# Altium schematic sheet Main.SchDoc
size A4; DrawnBy: Björn Seip; PageSetup: Record=PageOptions|CenterHorizontal=True|CenterVertical=True|PrintScale=0.97|XCorrection=1.00|YCorrection=1.00|PrintKind=0|BorderSize=5000000|LeftOffset=0|BottomOffset=0|Orientation=2|PaperLength=1000|PaperWidth=1000|Scale=100|PaperSource=7|PrintQuality=-4|MediaType=1|DitherType=10|PaperKind=A4|PrintScaleMode=1
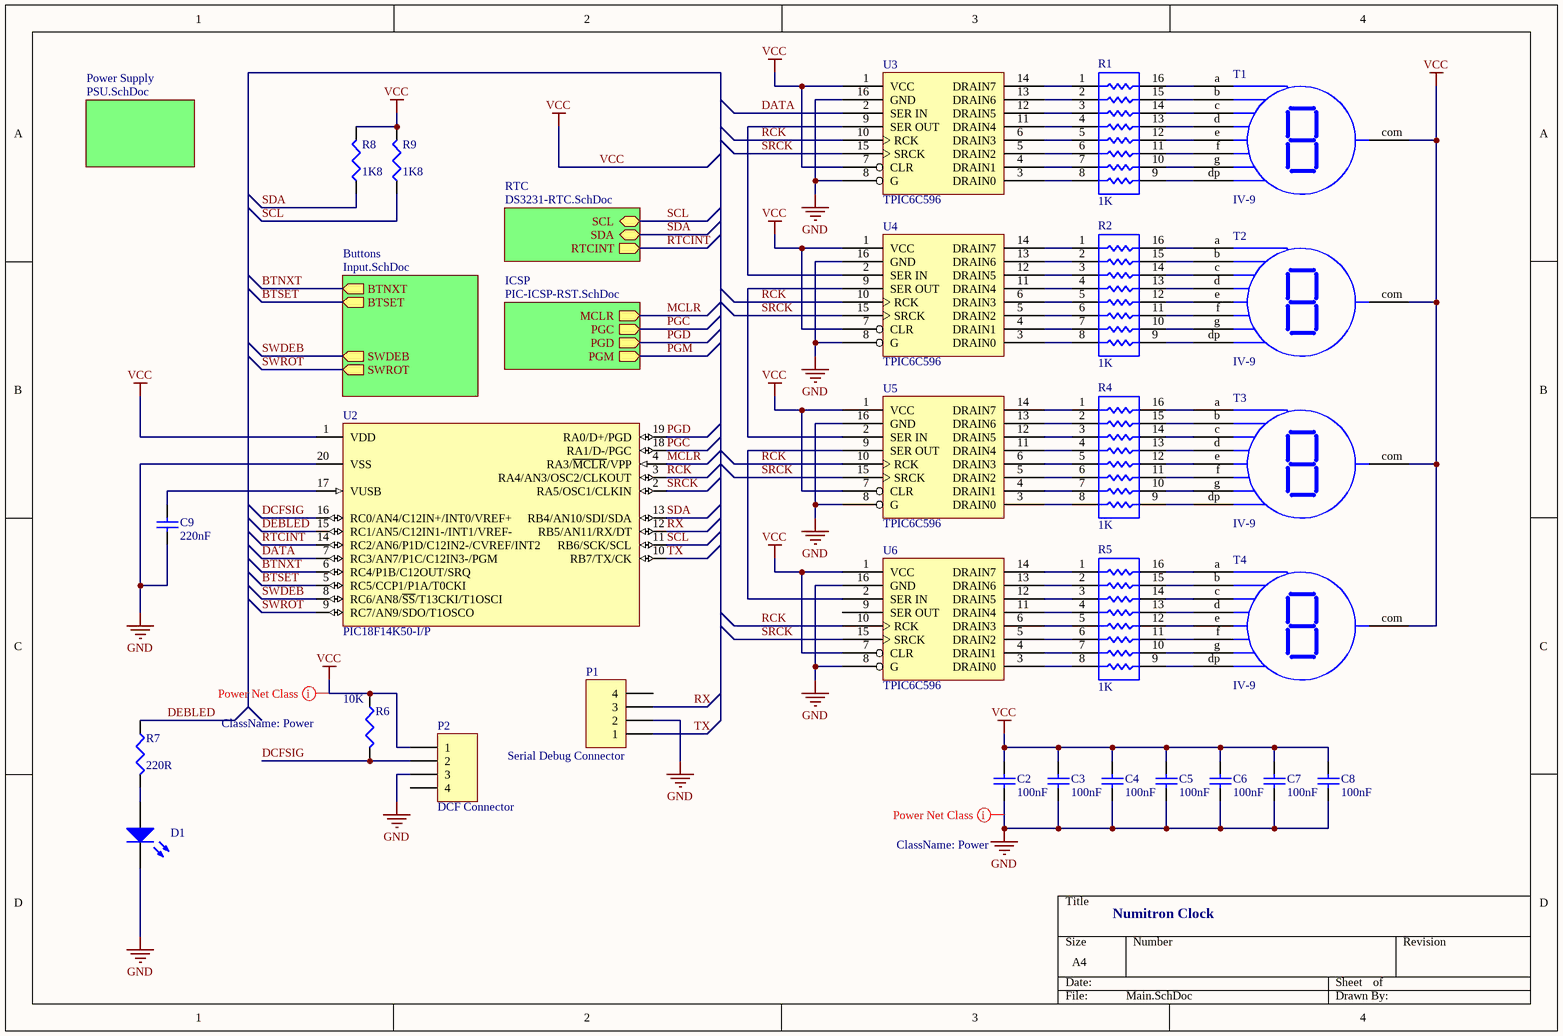
[diagram p0: Main.SchDoc]

## Parts
C2  value 100nF  [RCL 0805]  (hidden comment: Cap Semi)
C3  value 100nF  [RCL 0805]  (hidden comment: Cap Semi)
C4  value 100nF  [RCL 0805]  (hidden comment: Cap Semi)
C5  value 100nF  [RCL 0805]  (hidden comment: Cap Semi)
C6  value 100nF  [RCL 0805]  (hidden comment: Cap Semi)
C7  value 100nF  [RCL 0805]  (hidden comment: Cap Semi)
C8  value 100nF  [RCL 0805]  (hidden comment: Cap Semi)
C9  value 220nF  [RCL 0805]  (hidden comment: Cap Semi)
D1  LED2  [RCL 0805 POL]  (value not drawn)
P1  Serial Debug Connector  [PC Audio Connector]
P2  DCF Connector  [PC Audio Connector]
R1  value 1K  [DIP16]  (hidden comment: Res Pack3)
R2  value 1K  [DIP16]  (hidden comment: Res Pack3)
R4  value 1K  [DIP16]  (hidden comment: Res Pack3)
R5  value 1K  [DIP16]  (hidden comment: Res Pack3)
R6  value 10K  [RCL 0805]  (hidden comment: Res3)
R7  value 220R  [RCL 0805]  (hidden comment: Res3)
R8  value 1K8  [RCL 0805]  (hidden comment: I2C SDA PULLUP)
R9  value 1K8  [RCL 0805]  (hidden comment: I2C SCL PULLUP)
T1  IV-9  [IV-9]
T2  IV-9  [IV-9]
T3  IV-9  [IV-9]
T4  IV-9  [IV-9]
U2  PIC18F14K50-I/P  [DIP20]
U3  TPIC6C596  [DIP16]
U4  TPIC6C596  [DIP16]
U5  TPIC6C596  [DIP16]
U6  TPIC6C596  [DIP16]

## Sub-sheets
Buttons = Input.SchDoc: BTNXT (out), BTSET (out), SWDEB (out), SWROT (out)
ICSP = PIC-ICSP-RST.SchDoc: MCLR (out), PGC (out), PGD (out), PGM (out)
Power Supply = PSU.SchDoc: no entries
RTC = DS3231-RTC.SchDoc: SCL (bidir), SDA (bidir), RTCINT (out)

## Nets
GND: C2.1 C3.1 C4.1 C5.1 C6.1 C7.1 C8.1 C9.1 D1.2(K) P1.2 P2.3 U2.20(VSS) U3.8(G) U3.16(GND) U4.8(G) U4.16(GND) U5.8(G) U5.16(GND) U6.8(G) U6.16(GND)
VCC: C2.2 C3.2 C4.2 C5.2 C6.2 C7.2 C8.2 P2.1 R6.1 R8.2 R9.2 T1.com T2.com T3.com T4.com U2.1(VDD) U3.1(VCC) U3.7(CLR) U4.1(VCC) U4.7(CLR) U5.1(VCC) U5.7(CLR) U6.1(VCC) U6.7(CLR)
BTNXT: U2.6(RC4/P1B/C12OUT/SRQ) ; sheet Buttons/BTNXT
BTSET: U2.5(RC5/CCP1/P1A/T0CKI) ; sheet Buttons/BTSET
DATA: U2.7(RC3/AN7/P1C/C12IN3-/PGM) U3.2(SER_IN)
DCFSIG: P2.2 R6.2 U2.16(RC0/AN4/C12IN+/INT0/VREF+)
DEBLED: R7.1 U2.15(RC1/AN5/C12IN1-/INT1/VREF-)
MCLR: U2.4(RA3/~{MCLR}/VPP) ; sheet ICSP/MCLR
PGC: U2.18(RA1/D-/PGC) ; sheet ICSP/PGC
PGD: U2.19(RA0/D+/PGD) ; sheet ICSP/PGD
PGM: sheet ICSP/PGM
RCK: U2.3(RA4/AN3/OSC2/CLKOUT) U3.10(RCK) U4.10(RCK) U5.10(RCK) U6.10(RCK)
RTCINT: U2.14(RC2/AN6/P1D/C12IN2-/CVREF/INT2) ; sheet RTC/RTCINT
RX: P1.3 U2.12(RB5/AN11/RX/DT)
SCL: R9.1 U2.11(RB6/SCK/SCL) ; sheet RTC/SCL
SDA: R8.1 U2.13(RB4/AN10/SDI/SDA) ; sheet RTC/SDA
SRCK: U2.2(RA5/OSC1/CLKIN) U3.15(SRCK) U4.15(SRCK) U5.15(SRCK) U6.15(SRCK)
SWDEB: U2.8(RC6/AN8/~{SS}/T13CKI/T1OSCI) ; sheet Buttons/SWDEB
SWROT: U2.9(RC7/AN9/SDO/T1OSCO) ; sheet Buttons/SWROT
TX: P1.1 U2.10(RB7/TX/CK)
NetC9_2: C9.2 U2.17(VUSB)
NetD1_1: D1.1(A) R7.2
NetR1_1: R1.1 U3.14(DRAIN7)
NetR1_2: R1.2 U3.13(DRAIN6)
NetR1_3: R1.3 U3.12(DRAIN5)
NetR1_4: R1.4 U3.11(DRAIN4)
NetR1_5: R1.5 U3.6(DRAIN3)
NetR1_6: R1.6 U3.5(DRAIN2)
NetR1_7: R1.7 U3.4(DRAIN1)
NetR1_8: R1.8 U3.3(DRAIN0)
NetR1_9: R1.9 T1.dp
NetR1_10: R1.10 T1.g
NetR1_11: R1.11 T1.f
NetR1_12: R1.12 T1.e
NetR1_13: R1.13 T1.d
NetR1_14: R1.14 T1.c
NetR1_15: R1.15 T1.b
NetR1_16: R1.16 T1.a
NetR2_1: R2.1 U4.14(DRAIN7)
NetR2_2: R2.2 U4.13(DRAIN6)
NetR2_3: R2.3 U4.12(DRAIN5)
NetR2_4: R2.4 U4.11(DRAIN4)
NetR2_5: R2.5 U4.6(DRAIN3)
NetR2_6: R2.6 U4.5(DRAIN2)
NetR2_7: R2.7 U4.4(DRAIN1)
NetR2_8: R2.8 U4.3(DRAIN0)
NetR2_9: R2.9 T2.dp
NetR2_10: R2.10 T2.g
NetR2_11: R2.11 T2.f
NetR2_12: R2.12 T2.e
NetR2_13: R2.13 T2.d
NetR2_14: R2.14 T2.c
NetR2_15: R2.15 T2.b
NetR2_16: R2.16 T2.a
NetR4_1: R4.1 U5.14(DRAIN7)
NetR4_2: R4.2 U5.13(DRAIN6)
NetR4_3: R4.3 U5.12(DRAIN5)
NetR4_4: R4.4 U5.11(DRAIN4)
NetR4_5: R4.5 U5.6(DRAIN3)
NetR4_6: R4.6 U5.5(DRAIN2)
NetR4_7: R4.7 U5.4(DRAIN1)
NetR4_8: R4.8 U5.3(DRAIN0)
NetR4_9: R4.9 T3.dp
NetR4_10: R4.10 T3.g
NetR4_11: R4.11 T3.f
NetR4_12: R4.12 T3.e
NetR4_13: R4.13 T3.d
NetR4_14: R4.14 T3.c
NetR4_15: R4.15 T3.b
NetR4_16: R4.16 T3.a
NetR5_1: R5.1 U6.14(DRAIN7)
NetR5_2: R5.2 U6.13(DRAIN6)
NetR5_3: R5.3 U6.12(DRAIN5)
NetR5_4: R5.4 U6.11(DRAIN4)
NetR5_5: R5.5 U6.6(DRAIN3)
NetR5_6: R5.6 U6.5(DRAIN2)
NetR5_7: R5.7 U6.4(DRAIN1)
NetR5_8: R5.8 U6.3(DRAIN0)
NetR5_9: R5.9 T4.dp
NetR5_10: R5.10 T4.g
NetR5_11: R5.11 T4.f
NetR5_12: R5.12 T4.e
NetR5_13: R5.13 T4.d
NetR5_14: R5.14 T4.c
NetR5_15: R5.15 T4.b
NetR5_16: R5.16 T4.a
NetU3_9: U3.9(SER_OUT) U4.2(SER_IN)
NetU4_9: U4.9(SER_OUT) U5.2(SER_IN)
NetU5_9: U5.9(SER_OUT) U6.2(SER_IN)

Not connected (* = marked no-connect by the designer): P1 4; P2 4; U6 9(SER_OUT)

## Layout directives
net class Power: GND, VCC

## Notes on the sheet
- Numitron Clock

## Library data of the parts
C2-C9 = Cap Semi: Capacitor (Semiconductor SIM Model); Published: 8-Jun-2000; LatestRevisionDate: 29-May-2009; LatestRevisionNote: IPC-7351 Footprint Added.; PackageReference: C1206; Publisher: Altium Limited; PackageDescription: Chip Capacitor
D1 = LED2: Typical RED, GREEN, YELLOW, AMBER GaAs LED; Published: 8-Jun-2000; LatestRevisionDate: 17-Jul-2002; LatestRevisionNote: Re-released for DXP Platform.; PackageVersion: Feb-2002; PackageReference: 3.2X1.6X1.1; Publisher: Altium Limited
P1 P2 = Header 4: Header, 4-Pin; LatestRevisionDate: 17-Jul-2002; LatestRevisionNote: Re-released for DXP Platform.; Publisher: Altium Limited
R1 R2 R4 R5 = Res Pack3: Isolated Resistor Network; Published: 24-Mar-1999; LatestRevisionDate: 29-May-2009; LatestRevisionNote: IPC-7351 Footprint Added.; PackageReference: SO-16; Publisher: Altium Limited; PackageDescription: 16-Pin Small Outline Integrated Circuit 1.27 mm Pitch; Code_JEDEC: MS-012-AC; Code_IPC: SOIC127P600-16
R6-R9 = Res3: Resistor; Published: 8-Jun-2000; LatestRevisionDate: 29-May-2009; LatestRevisionNote: IPC-7351 Footprint Added.; PackageReference: J1-0603; Publisher: Altium Limited; PackageDescription: Chip Resistor
T1-T4 = IV-9: pin to pad: a>5 b>3 c>4 com>1 d>8 dp>2 e>9 f>6 g>7
U2 = PIC18F14K50-I/P: USB Flash Microcontroller with nanoWatt XLP Technology, 20-pin PDIP, Industrial Temperature; FirstPublished: 2-Dec-2009; DatasheetVersion: revC, Mar-2009; PackageVersion: revBB, Aug-2009; PackageReference: PDIP300-P20; Publisher: Altium Limited; PackageDescription: 20-Lead Plastic Dual In-Line (P) - 300 mil Body [PDIP]; Supplier 1: Digi-Key; Supplier Part Number 1: PIC18F14K50-I/P-ND; Supplier 2: Farnell; Supplier Part Number 2: 1648501; Supplier 3: Newark; Supplier Part Number 3: 77M3103; ComponentLink1Description: Datasheet; ComponentLink1URL: http://ww1.microchip.com/downloads/en/DeviceDoc/41350C.pdf; ComponentLink2Description: Packaging Specification; ComponentLink2URL: http://www.microchip.com/stellent/groups/techpub_sg/documents/packagingspec/en012702.pdf; ComponentLink3Description: Microchip.com Home; ComponentLink3URL: http://www.microchip.com/
U3-U6 = TPIC6C596: Supplier 1: Digi-Key; Supplier Part Number 1: 296-9015-5-ND